# Altium schematic sheet machin.SchDoc
size A0; SheetNumber: 1; SheetTotal: 1
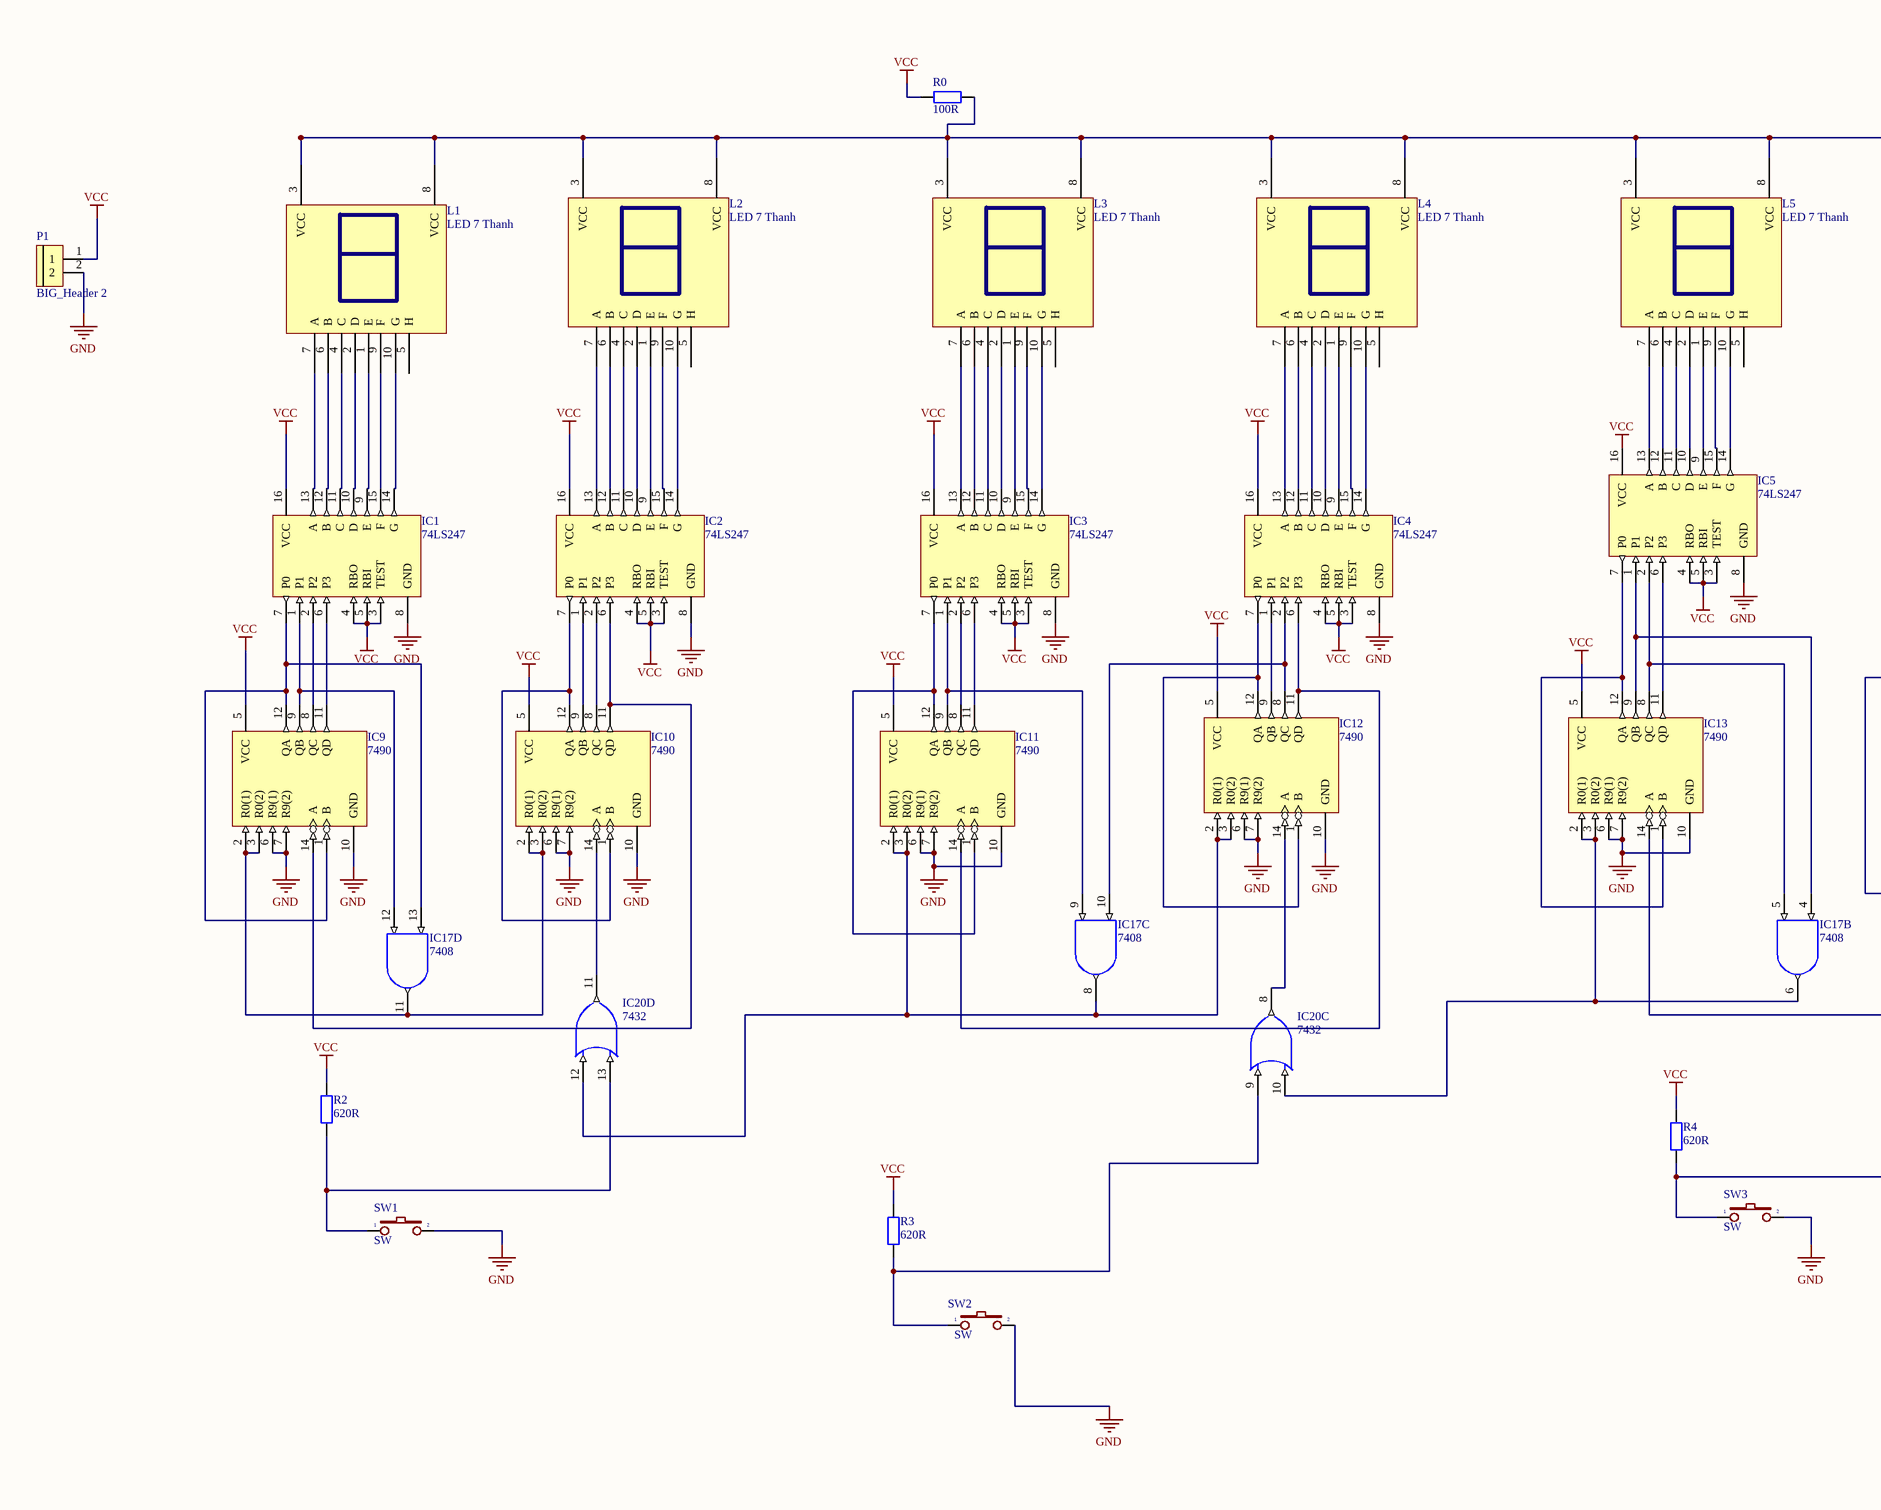
[diagram p0: machin.SchDoc, left]
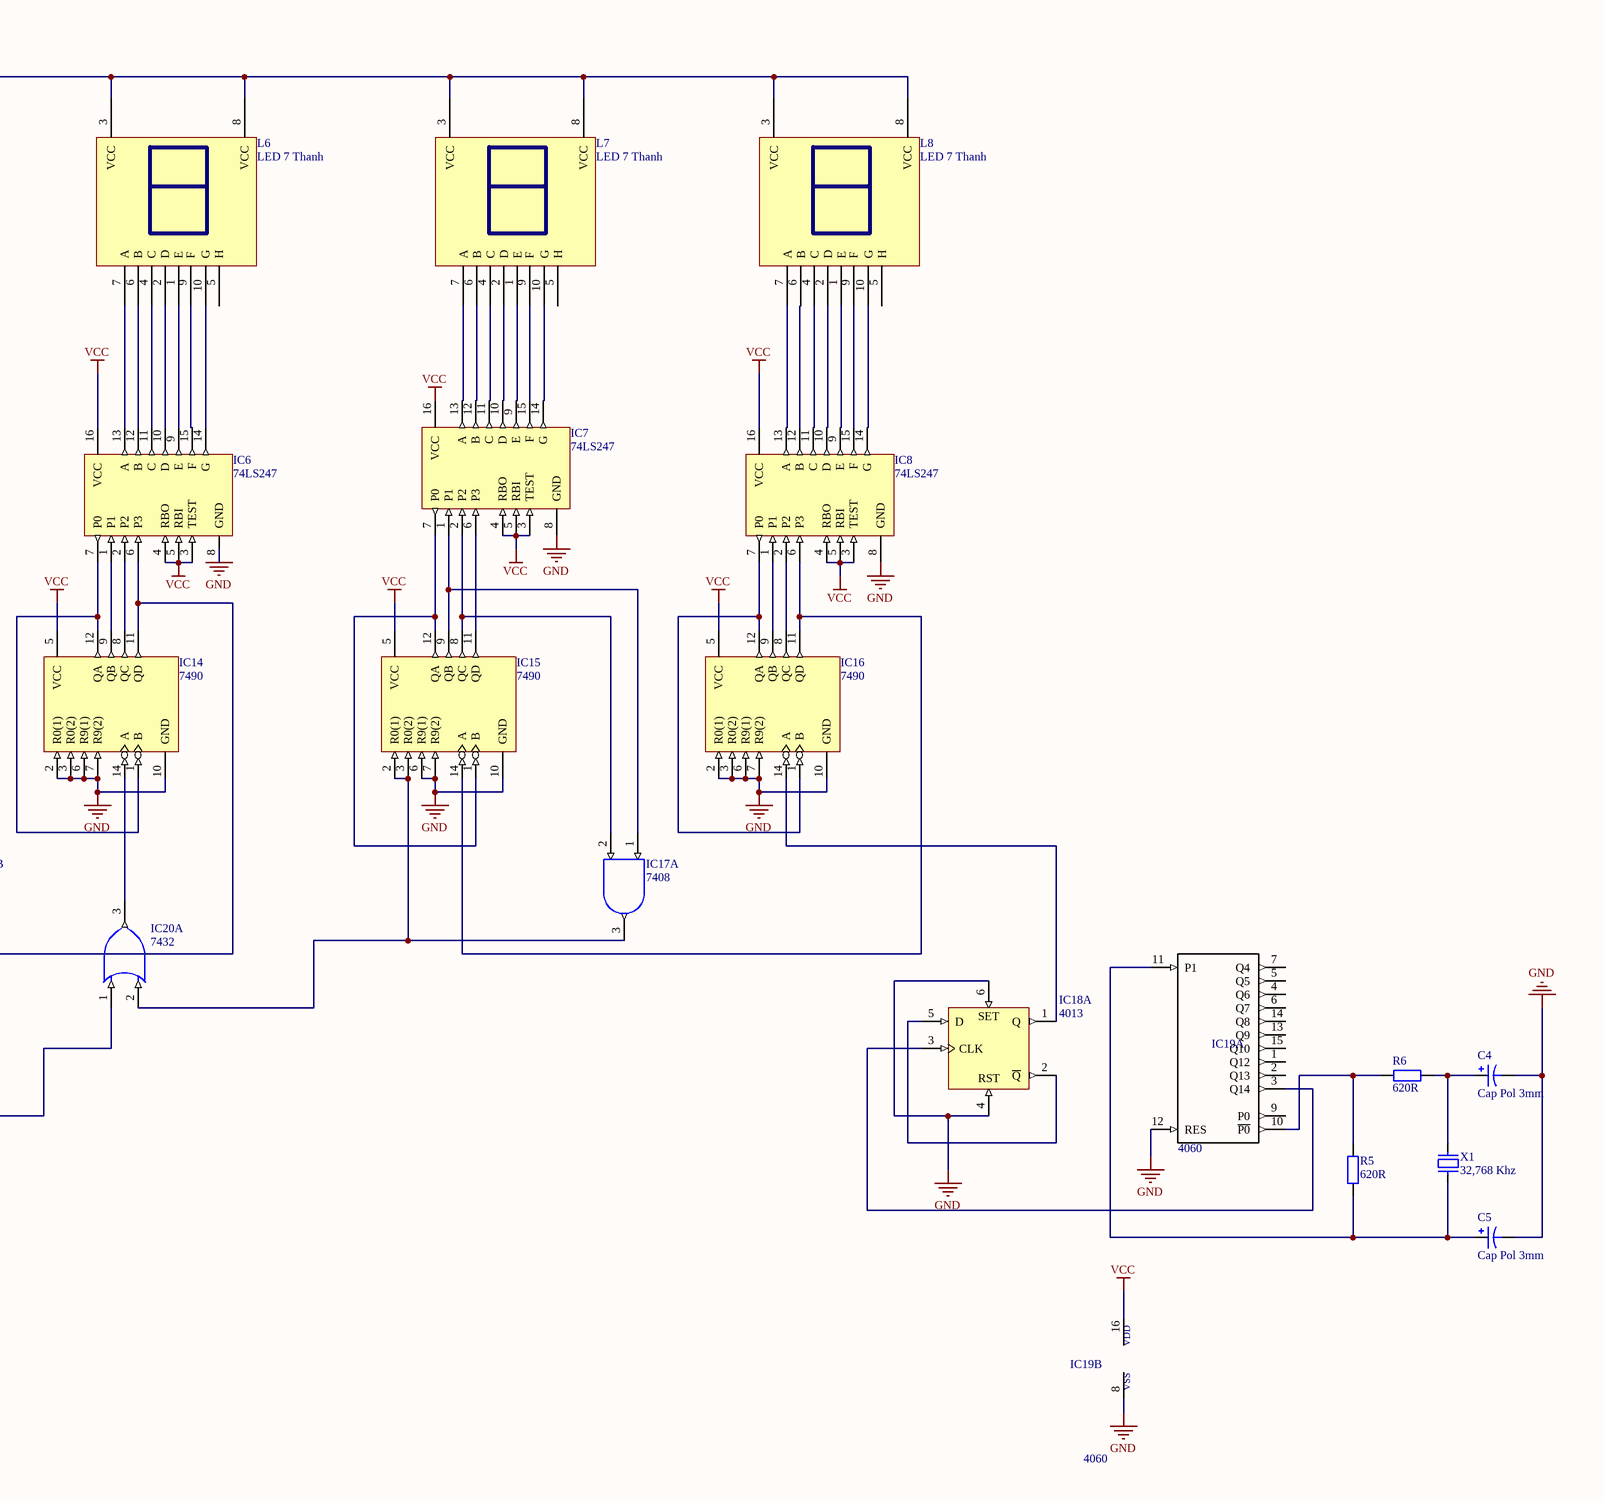
[diagram p1: machin.SchDoc, right]

## Parts
C4  Cap Pol 3mm  [C3MM]
C5  Cap Pol 3mm  [C3MM]
IC1  74LS247  [DIP16]
IC2  74LS247  [DIP16]
IC3  74LS247  [DIP16]
IC4  74LS247  [DIP16]
IC5  74LS247  [DIP16]
IC6  74LS247  [DIP16]
IC7  74LS247  [DIP16]
IC8  74LS247  [DIP16]
IC9  7490  [DIP14/W0.3]
IC10  7490  [DIP14/W0.3]
IC11  7490  [DIP14/W0.3]
IC12  7490  [DIP14/W0.3]
IC13  7490  [DIP14/W0.3]
IC14  7490  [DIP14/W0.3]
IC15  7490  [DIP14/W0.3]
IC16  7490  [DIP14/W0.3]
IC17  7408  [DIP14/W0.3]  (parts A,B,C,D of 4)
IC18  4013  [DIP14]  (part A of 2)
IC19  4060  [*DIL16]  (parts A,B of 2)
IC20  7432  [DIP14/W0.3]  (parts A,C,D of 4)
L1  LED 7 Thanh  [LED 7x1 0.56]
L2  LED 7 Thanh  [LED 7x1 0.56]
L3  LED 7 Thanh  [LED 7x1 0.56]
L4  LED 7 Thanh  [LED 7x1 0.56]
L5  LED 7 Thanh  [LED 7x1 0.56]
L6  LED 7 Thanh  [LED 7x1 0.56]
L7  LED 7 Thanh  [LED 7x1 0.56]
L8  LED 7 Thanh  [LED 7x1 0.56]
P1  BIG_Header 2  [BIG_Header 2]
R0  100R  [tro vach 1/2w]
R2  620R  [tro vach 1/4w]
R3  620R  [tro vach 1/4w]
R4  620R  [tro vach 1/4w]
R5  620R  [tro vach 1/4w]
R6  620R  [tro vach 1/4w]
SW1  SW  [SW2]
SW2  SW  [SW2]
SW3  SW  [SW2]
X1  32,768 Khz  [XT32k]

## Nets
GND: C4.2 C5.2 IC1.8(GND) IC2.8(GND) IC3.8(GND) IC4.8(GND) IC5.8(GND) IC6.8(GND) IC7.8(GND) IC8.8(GND) IC9.6(R9(1)) IC9.7(R9(2)) IC9.10(GND) IC10.6(R9(1)) IC10.7(R9(2)) IC10.10(GND) IC11.6(R9(1)) IC11.7(R9(2)) IC11.10(GND) IC12.6(R9(1)) IC12.7(R9(2)) IC12.10(GND) IC13.6(R9(1)) IC13.7(R9(2)) IC13.10(GND) IC14.2(R0(1)) IC14.3(R0(2)) IC14.6(R9(1)) IC14.7(R9(2)) IC14.10(GND) IC15.6(R9(1)) IC15.7(R9(2)) IC15.10(GND) IC16.2(R0(1)) IC16.3(R0(2)) IC16.6(R9(1)) IC16.7(R9(2)) IC16.10(GND) IC17.7(GND) IC18.4(RST) IC18.6(S) IC18.7(GND) IC19.8(VSS) IC19.12(RES) IC20.7(GND) P1.2 SW1.2 SW2.2 SW3.2
VCC: IC1.3(TEST) IC1.4(RBO) IC1.5(RBI) IC1.16(VCC) IC2.3(TEST) IC2.4(RBO) IC2.5(RBI) IC2.16(VCC) IC3.3(TEST) IC3.4(RBO) IC3.5(RBI) IC3.16(VCC) IC4.3(TEST) IC4.4(RBO) IC4.5(RBI) IC4.16(VCC) IC5.3(TEST) IC5.4(RBO) IC5.5(RBI) IC5.16(VCC) IC6.3(TEST) IC6.4(RBO) IC6.5(RBI) IC6.16(VCC) IC7.3(TEST) IC7.4(RBO) IC7.5(RBI) IC7.16(VCC) IC8.3(TEST) IC8.4(RBO) IC8.5(RBI) IC8.16(VCC) IC9.5(VCC) IC10.5(VCC) IC11.5(VCC) IC12.5(VCC) IC13.5(VCC) IC14.5(VCC) IC15.5(VCC) IC16.5(VCC) IC17.14(VCC) IC19.16(VDD) IC20.14(VCC) P1.1 R0.1 R2.2 R3.2 R4.2
VDD: IC18.14(VDD)
NetC4_1: C4.1 R6.1 X1.2
NetC5_1: C5.1 IC19.11(P1) R5.1 X1.1
NetIC1_1: IC1.1(P1) IC9.9(QB) IC17.12(B)
NetIC1_2: IC1.2(P2) IC9.8(QC)
NetIC1_6: IC1.6(P3) IC9.11(QD)
NetIC1_7: IC1.7(P0) IC9.1(B) IC9.12(QA) IC17.13(A)
NetIC1_9: IC1.9(E) L1.1(E)
NetIC1_10: IC1.10(D) L1.2(D)
NetIC1_11: IC1.11(C) L1.4(C)
NetIC1_12: IC1.12(B) L1.6(B)
NetIC1_13: IC1.13(A) L1.7(A)
NetIC1_14: IC1.14(G) L1.10(G)
NetIC1_15: IC1.15(F) L1.9(F)
NetIC2_1: IC2.1(P1) IC10.9(QB)
NetIC2_2: IC2.2(P2) IC10.8(QC)
NetIC2_6: IC2.6(P3) IC9.14(A) IC10.11(QD)
NetIC2_7: IC2.7(P0) IC10.1(B) IC10.12(QA)
NetIC2_9: IC2.9(E) L2.1(E)
NetIC2_10: IC2.10(D) L2.2(D)
NetIC2_11: IC2.11(C) L2.4(C)
NetIC2_12: IC2.12(B) L2.6(B)
NetIC2_13: IC2.13(A) L2.7(A)
NetIC2_14: IC2.14(G) L2.10(G)
NetIC2_15: IC2.15(F) L2.9(F)
NetIC3_1: IC3.1(P1) IC11.9(QB) IC17.9(B)
NetIC3_2: IC3.2(P2) IC11.8(QC)
NetIC3_6: IC3.6(P3) IC11.11(QD)
NetIC3_7: IC3.7(P0) IC11.1(B) IC11.12(QA)
NetIC3_9: IC3.9(E) L3.1(E)
NetIC3_10: IC3.10(D) L3.2(D)
NetIC3_11: IC3.11(C) L3.4(C)
NetIC3_12: IC3.12(B) L3.6(B)
NetIC3_13: IC3.13(A) L3.7(A)
NetIC3_14: IC3.14(G) L3.10(G)
NetIC3_15: IC3.15(F) L3.9(F)
NetIC4_1: IC4.1(P1) IC12.9(QB)
NetIC4_2: IC4.2(P2) IC12.8(QC) IC17.10(A)
NetIC4_6: IC4.6(P3) IC11.14(A) IC12.11(QD)
NetIC4_7: IC4.7(P0) IC12.1(B) IC12.12(QA)
NetIC4_9: IC4.9(E) L4.1(E)
NetIC4_10: IC4.10(D) L4.2(D)
NetIC4_11: IC4.11(C) L4.4(C)
NetIC4_12: IC4.12(B) L4.6(B)
NetIC4_13: IC4.13(A) L4.7(A)
NetIC4_14: IC4.14(G) L4.10(G)
NetIC4_15: IC4.15(F) L4.9(F)
NetIC5_1: IC5.1(P1) IC13.9(QB) IC17.4(A)
NetIC5_2: IC5.2(P2) IC13.8(QC) IC17.5(B)
NetIC5_6: IC5.6(P3) IC13.11(QD)
NetIC5_7: IC5.7(P0) IC13.1(B) IC13.12(QA)
NetIC5_9: IC5.9(E) L5.1(E)
NetIC5_10: IC5.10(D) L5.2(D)
NetIC5_11: IC5.11(C) L5.4(C)
NetIC5_12: IC5.12(B) L5.6(B)
NetIC5_13: IC5.13(A) L5.7(A)
NetIC5_14: IC5.14(G) L5.10(G)
NetIC5_15: IC5.15(F) L5.9(F)
NetIC6_1: IC6.1(P1) IC14.9(QB)
NetIC6_2: IC6.2(P2) IC14.8(QC)
NetIC6_6: IC6.6(P3) IC13.14(A) IC14.11(QD)
NetIC6_7: IC6.7(P0) IC14.1(B) IC14.12(QA)
NetIC6_9: IC6.9(E) L6.1(E)
NetIC6_10: IC6.10(D) L6.2(D)
NetIC6_11: IC6.11(C) L6.4(C)
NetIC6_12: IC6.12(B) L6.6(B)
NetIC6_13: IC6.13(A) L6.7(A)
NetIC6_14: IC6.14(G) L6.10(G)
NetIC6_15: IC6.15(F) L6.9(F)
NetIC7_1: IC7.1(P1) IC15.9(QB) IC17.1(A)
NetIC7_2: IC7.2(P2) IC15.8(QC) IC17.2(B)
NetIC7_6: IC7.6(P3) IC15.11(QD)
NetIC7_7: IC7.7(P0) IC15.1(B) IC15.12(QA)
NetIC7_9: IC7.9(E) L7.1(E)
NetIC7_10: IC7.10(D) L7.2(D)
NetIC7_11: IC7.11(C) L7.4(C)
NetIC7_12: IC7.12(B) L7.6(B)
NetIC7_13: IC7.13(A) L7.7(A)
NetIC7_14: IC7.14(G) L7.10(G)
NetIC7_15: IC7.15(F) L7.9(F)
NetIC8_1: IC8.1(P1) IC16.9(QB)
NetIC8_2: IC8.2(P2) IC16.8(QC)
NetIC8_6: IC8.6(P3) IC15.14(A) IC16.11(QD)
NetIC8_7: IC8.7(P0) IC16.1(B) IC16.12(QA)
NetIC8_9: IC8.9(E) L8.1(E)
NetIC8_10: IC8.10(D) L8.2(D)
NetIC8_11: IC8.11(C) L8.4(C)
NetIC8_12: IC8.12(B) L8.6(B)
NetIC8_13: IC8.13(A) L8.7(A)
NetIC8_14: IC8.14(G) L8.10(G)
NetIC8_15: IC8.15(F) L8.9(F)
NetIC9_2: IC9.2(R0(1)) IC9.3(R0(2)) IC10.2(R0(1)) IC10.3(R0(2)) IC17.11(O)
NetIC10_14: IC10.14(A) IC20.11(Y)
NetIC11_2: IC11.2(R0(1)) IC11.3(R0(2)) IC12.2(R0(1)) IC12.3(R0(2)) IC17.8(O) IC20.12(A)
NetIC12_14: IC12.14(A) IC20.8(Y)
NetIC13_2: IC13.2(R0(1)) IC13.3(R0(2)) IC17.6(O) IC20.10(B)
NetIC14_14: IC14.14(A) IC20.3(Y)
NetIC15_2: IC15.2(R0(1)) IC15.3(R0(2)) IC17.3(O) IC20.2(B)
NetIC16_14: IC16.14(A) IC18.1(Q)
NetIC18_2: IC18.2(~{Q}) IC18.5(D)
NetIC18_3: IC18.3(CLK) IC19.3(Q14)
NetIC19_10: IC19.10(~{P0}) R5.2 R6.2
NetIC20_1: IC20.1(A) R4.1 SW3.1
NetIC20_9: IC20.9(A) R3.1 SW2.1
NetIC20_13: IC20.13(B) R2.1 SW1.1
NetL1_3: L1.3(VCC) L1.8(VCC) L2.3(VCC) L2.8(VCC) L3.3(VCC) L3.8(VCC) L4.3(VCC) L4.8(VCC) L5.3(VCC) L5.8(VCC) L6.3(VCC) L6.8(VCC) L7.3(VCC) L7.8(VCC) L8.3(VCC) L8.8(VCC) R0.2

Not connected (* = marked no-connect by the designer): IC19 1(Q12) 2(Q13) 4(Q6) 5(Q5) 6(Q7) 7(Q4) 9(P0) 13(Q9) 14(Q8) 15(Q10); L1 5(H); L2 5(H); L3 5(H); L4 5(H); L5 5(H); L6 5(H); L7 5(H); L8 5(H)

## Notes on the sheet
- (in symbol 4013, part A) SET

## Library data of the parts
C4 C5 = Cap Pol 3mm: Polarized Capacitor (Axial); Published: 8-Jun-2000; LatestRevisionDate: 17-Jul-2002; LatestRevisionNote: Re-released for DXP Platform.; PackageReference: POLAR0.8; Publisher: Altium Limited
IC1-IC8 = 74247: Value: 74LS238; Copyright by: VanDungEvn@Gmail.com
IC9-IC16 = 7490: 4-Bit Decade Counter; Value: 7490
IC17 = 7408: Quad 2-Input AND Gate; Value: 7408
IC18 = 4013: Dual D-Type Flip-Flop; Creat by: VanDungEvn@Gmail.com
IC19 = 4060: / Standoff; Round; Nylon; 6-32x3/8 Thread; 1/4 OD; 3/4 Length | Abbatron / HH Smith 4060 /; SnapEDA_Link: https://www.snapeda.com/parts/4060/Abbatron/view-part/?ref=snap; Package: TO-252-3 Abbatron; MF: Abbatron; MP: 4060; Check_prices: https://www.snapeda.com/parts/4060/Abbatron/view-part/?ref=eda; Value: *
IC20 = 7432: Quad 2-Input OR Gate
L1-L8 = LED 7x1 0.56 Anot: Dán; Don_Vi: Con; Ma_Hang: MH000834; Ten_Linh_Kien: Led 7 0.56 1 Số Anot (Sáng Đỏ); Ghi_Chu: *; Kieu_Chan: *; Chung_Loai: Dán
R0 = Tro Vach 1/2W 5% 100R: Cắm; So_Chan: 2; Ten_Linh_Kien: Trở 5% 1/2w 100R; Ma_Hang: MH007106; Don_Vi: Con; Chung_Loai: Cắm; Kieu_Chan: *
R2-R6 = Tro Vach 1/4W 5% 620R: Cắm; Don_Vi: Con; So_Chan: 2; Ten_Linh_Kien: Trở Vạch 1/4W 5% 620R; Ma_Hang: MH007407; Chung_Loai: Cắm; Kieu_Chan: *
SW1-SW3 = SW2: Switch button 2 pin; Value: SW chip 2 pin
X1 = XT32k: Crystal 32,768kHz for timer real; Value: 32,768khz